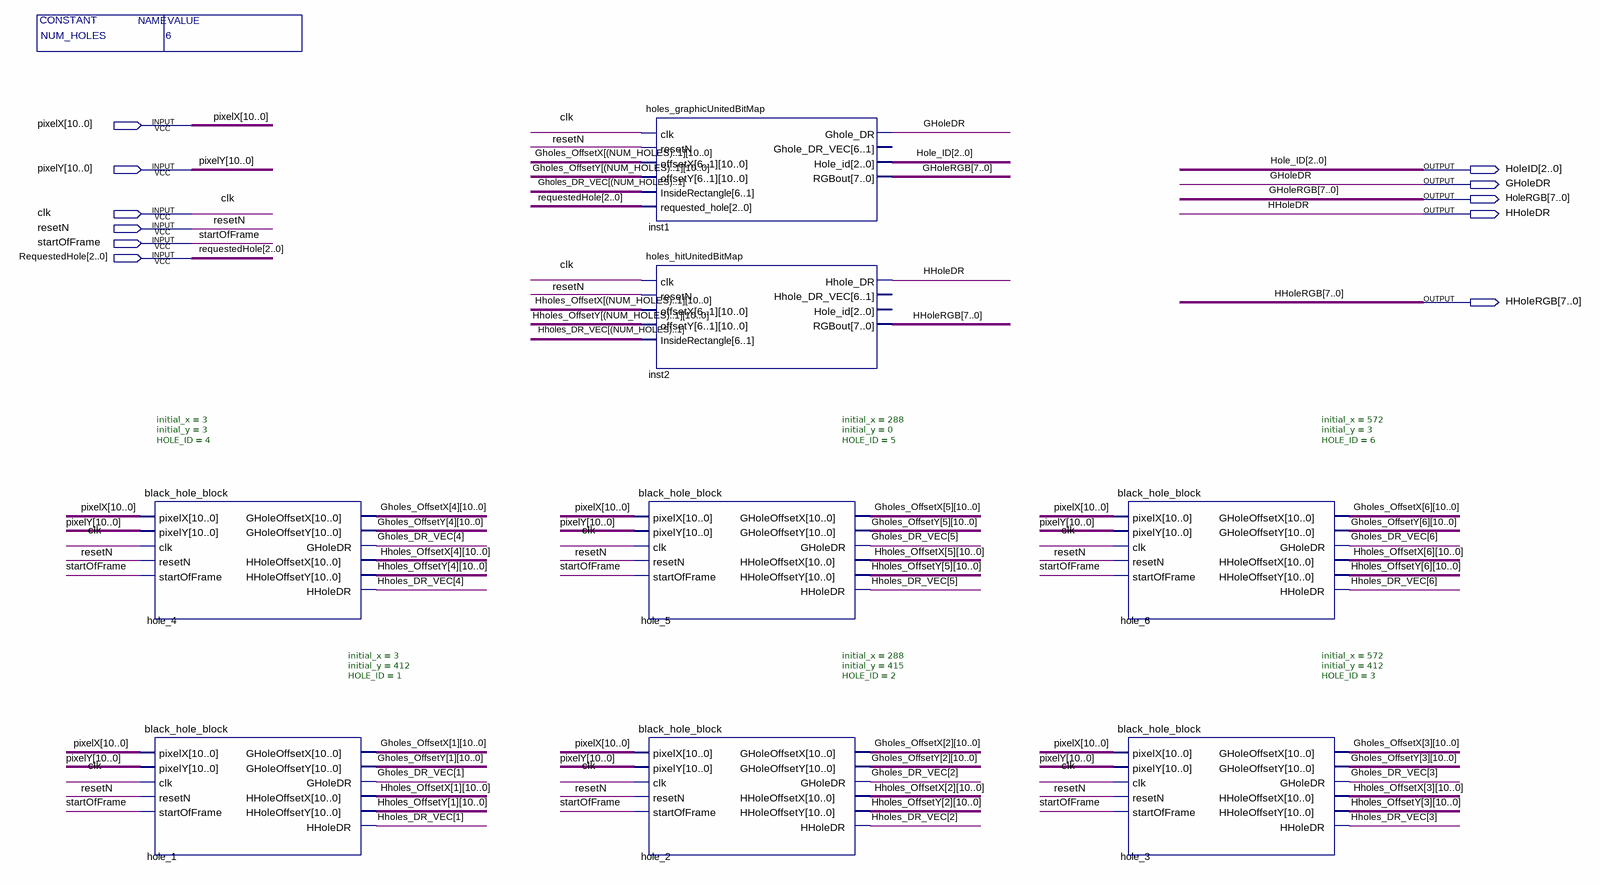
[diagram p0: schematic sheet]
// Quartus schematic all_holes_block.bdf as structural Verilog: 8 symbols, 11 pins
module all_holes_block #(parameter NUM_HOLES = 6) (
  input  [10:0] pixelX,
  input  [10:0] pixelY,
  input  clk,
  input  resetN,
  input  startOfFrame,
  input  [2:0] RequestedHole,
  output [2:0] HoleID,
  output GHoleDR,
  output [7:0] HoleRGB,
  output HHoleDR,
  output [7:0] HHoleRGB
);

  wire [6:1] Gholes_DR_VEC, Hholes_DR_VEC;
  wire [10:0] Gholes_OffsetX_1, Gholes_OffsetX_2, Gholes_OffsetX_3, Gholes_OffsetX_4, Gholes_OffsetX_5,
       Gholes_OffsetX_6, Gholes_OffsetY_1, Gholes_OffsetY_2, Gholes_OffsetY_3, Gholes_OffsetY_4,
       Gholes_OffsetY_5, Gholes_OffsetY_6, Hholes_OffsetX_1, Hholes_OffsetX_2, Hholes_OffsetX_3,
       Hholes_OffsetX_4, Hholes_OffsetX_5, Hholes_OffsetX_6, Hholes_OffsetY_1, Hholes_OffsetY_2,
       Hholes_OffsetY_3, Hholes_OffsetY_4, Hholes_OffsetY_5, Hholes_OffsetY_6;

  black_hole_block #(.initial_x(3), .initial_y(3), .HOLE_ID(4)) hole_4 (
    .pixelX(pixelX), .pixelY(pixelY), .clk(clk), .resetN(resetN), .startOfFrame(startOfFrame),
    .GHoleOffsetX(Gholes_OffsetX_4), .GHoleOffsetY(Gholes_OffsetY_4), .GHoleDR(Gholes_DR_VEC[4]),
    .HHoleOffsetX(Hholes_OffsetX_4), .HHoleOffsetY(Hholes_OffsetY_4), .HHoleDR(Hholes_DR_VEC[4]));
  black_hole_block #(.initial_x(3), .initial_y(412), .HOLE_ID(1)) hole_1 (
    .pixelX(pixelX), .pixelY(pixelY), .clk(clk), .resetN(resetN), .startOfFrame(startOfFrame),
    .GHoleOffsetX(Gholes_OffsetX_1), .GHoleOffsetY(Gholes_OffsetY_1), .GHoleDR(Gholes_DR_VEC[1]),
    .HHoleOffsetX(Hholes_OffsetX_1), .HHoleOffsetY(Hholes_OffsetY_1), .HHoleDR(Hholes_DR_VEC[1]));
  holes_graphicUnitedBitMap inst1 (
    .clk(clk), .resetN(resetN),
    .offsetX({Gholes_OffsetX_6, Gholes_OffsetX_5, Gholes_OffsetX_4, Gholes_OffsetX_3, Gholes_OffsetX_2, Gholes_OffsetX_1}),
    .offsetY({Gholes_OffsetY_6, Gholes_OffsetY_5, Gholes_OffsetY_4, Gholes_OffsetY_3, Gholes_OffsetY_2, Gholes_OffsetY_1}),
    .InsideRectangle(Gholes_DR_VEC), .requested_hole(RequestedHole), .Ghole_DR(GHoleDR), .Hole_id(HoleID),
    .RGBout(HoleRGB));  // open: Ghole_DR_VEC
  holes_hitUnitedBitMap inst2 (
    .clk(clk), .resetN(resetN),
    .offsetX({Hholes_OffsetX_6, Hholes_OffsetX_5, Hholes_OffsetX_4, Hholes_OffsetX_3, Hholes_OffsetX_2, Hholes_OffsetX_1}),
    .offsetY({Hholes_OffsetY_6, Hholes_OffsetY_5, Hholes_OffsetY_4, Hholes_OffsetY_3, Hholes_OffsetY_2, Hholes_OffsetY_1}),
    .InsideRectangle(Hholes_DR_VEC), .Hhole_DR(HHoleDR), .RGBout(HHoleRGB));  // open: Hhole_DR_VEC, Hole_id
  black_hole_block #(.initial_x(288), .initial_y(0), .HOLE_ID(5)) hole_5 (
    .pixelX(pixelX), .pixelY(pixelY), .clk(clk), .resetN(resetN), .startOfFrame(startOfFrame),
    .GHoleOffsetX(Gholes_OffsetX_5), .GHoleOffsetY(Gholes_OffsetY_5), .GHoleDR(Gholes_DR_VEC[5]),
    .HHoleOffsetX(Hholes_OffsetX_5), .HHoleOffsetY(Hholes_OffsetY_5), .HHoleDR(Hholes_DR_VEC[5]));
  black_hole_block #(.initial_x(288), .initial_y(415), .HOLE_ID(2)) hole_2 (
    .pixelX(pixelX), .pixelY(pixelY), .clk(clk), .resetN(resetN), .startOfFrame(startOfFrame),
    .GHoleOffsetX(Gholes_OffsetX_2), .GHoleOffsetY(Gholes_OffsetY_2), .GHoleDR(Gholes_DR_VEC[2]),
    .HHoleOffsetX(Hholes_OffsetX_2), .HHoleOffsetY(Hholes_OffsetY_2), .HHoleDR(Hholes_DR_VEC[2]));
  black_hole_block #(.initial_x(572), .initial_y(3), .HOLE_ID(6)) hole_6 (
    .pixelX(pixelX), .pixelY(pixelY), .clk(clk), .resetN(resetN), .startOfFrame(startOfFrame),
    .GHoleOffsetX(Gholes_OffsetX_6), .GHoleOffsetY(Gholes_OffsetY_6), .GHoleDR(Gholes_DR_VEC[6]),
    .HHoleOffsetX(Hholes_OffsetX_6), .HHoleOffsetY(Hholes_OffsetY_6), .HHoleDR(Hholes_DR_VEC[6]));
  black_hole_block #(.initial_x(572), .initial_y(412), .HOLE_ID(3)) hole_3 (
    .pixelX(pixelX), .pixelY(pixelY), .clk(clk), .resetN(resetN), .startOfFrame(startOfFrame),
    .GHoleOffsetX(Gholes_OffsetX_3), .GHoleOffsetY(Gholes_OffsetY_3), .GHoleDR(Gholes_DR_VEC[3]),
    .HHoleOffsetX(Hholes_OffsetX_3), .HHoleOffsetY(Hholes_OffsetY_3), .HHoleDR(Hholes_DR_VEC[3]));

  // Other names for the same wires on the sheet: GHoleRGB[7:0] = HoleRGB; Hole_ID[2:0] = HoleID
endmodule
